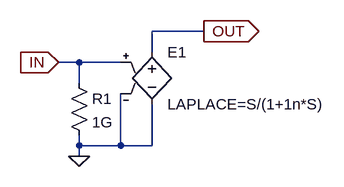
[diagram p0: schematic Derivative.asc]
Derivative.asc, the LTspice schematic file:
Version 4
SHEET 1 880 680
WIRE 240 -16 160 -16
WIRE 160 16 160 -16
WIRE 48 32 16 32
WIRE 112 32 48 32
WIRE 48 64 48 32
WIRE 48 160 48 144
WIRE 112 160 112 80
WIRE 112 160 48 160
WIRE 160 160 160 96
WIRE 160 160 112 160
WIRE 48 176 48 160
FLAG 240 -16 OUT
IOPIN 240 -16 Out
FLAG 16 32 IN
IOPIN 16 32 In
FLAG 48 176 0
SYMBOL res 32 48 R0
SYMATTR InstName R1
SYMATTR Value 1G
SYMBOL e 160 0 R0
SYMATTR InstName E1
SYMATTR Value LAPLACE=S/(1+1n*S)

The netlist it stands for:
* Derivative.asc
R1 IN 0 1G
E1 OUT 0 IN 0 LAPLACE=S/(1+1n*S)
.backanno
.end